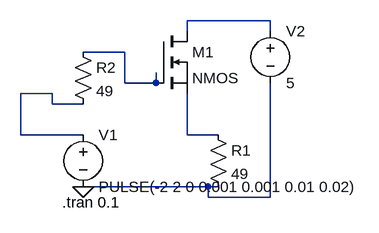
[diagram p0: schematic NMOS_Imp.asc]
NMOS_Imp.asc, the LTspice schematic file:
Version 4
SHEET 1 880 680
WIRE 336 -48 208 -48
WIRE 208 -32 208 -48
WIRE 336 -32 336 -48
WIRE 112 0 48 0
WIRE 112 48 112 0
WIRE 160 48 160 32
WIRE 160 48 112 48
WIRE 0 64 -48 64
WIRE 0 80 0 64
WIRE 48 80 0 80
WIRE -48 128 -48 64
WIRE 48 128 -48 128
WIRE 208 128 208 64
WIRE 256 128 208 128
WIRE 240 208 48 208
WIRE 256 208 240 208
WIRE 240 224 240 208
WIRE 336 224 336 48
WIRE 336 224 240 224
FLAG 48 208 0
SYMBOL voltage 48 112 R0
WINDOW 123 0 0 Left 2
WINDOW 39 0 0 Left 2
SYMATTR InstName V1
SYMATTR Value PULSE(-2 2 0 0.001 0.001 0.01 0.02)
SYMBOL res 240 112 R0
SYMATTR InstName R1
SYMATTR Value 49
SYMBOL res 32 -16 R0
SYMATTR InstName R2
SYMATTR Value 49
SYMBOL voltage 336 -48 R0
WINDOW 123 0 0 Left 2
WINDOW 39 0 0 Left 2
SYMATTR InstName V2
SYMATTR Value 5
SYMBOL nmos 160 -32 R0
SYMATTR InstName M1
TEXT 16 232 Left 2 !.tran 0.1

The netlist it stands for:
* NMOS_Imp.asc
V1 N003 0 PULSE(-2 2 0 0.001 0.001 0.01 0.02)
R1 N004 0 49
R2 N002 N003 49
V2 N001 0 5
M1 N001 N002 N004 N004 NMOS
.model NMOS NMOS
.model PMOS PMOS
.lib standard.mos
.tran 0.1
.backanno
.end